# Altium project MiniPC.PrjPcb (part 15 of 17)

## Sheet 3.3V_to_VADJ.SchDoc: 3.3V to VADJ converter
size B; DocumentNumber: 43; SheetNumber: 43; SheetTotal: 46
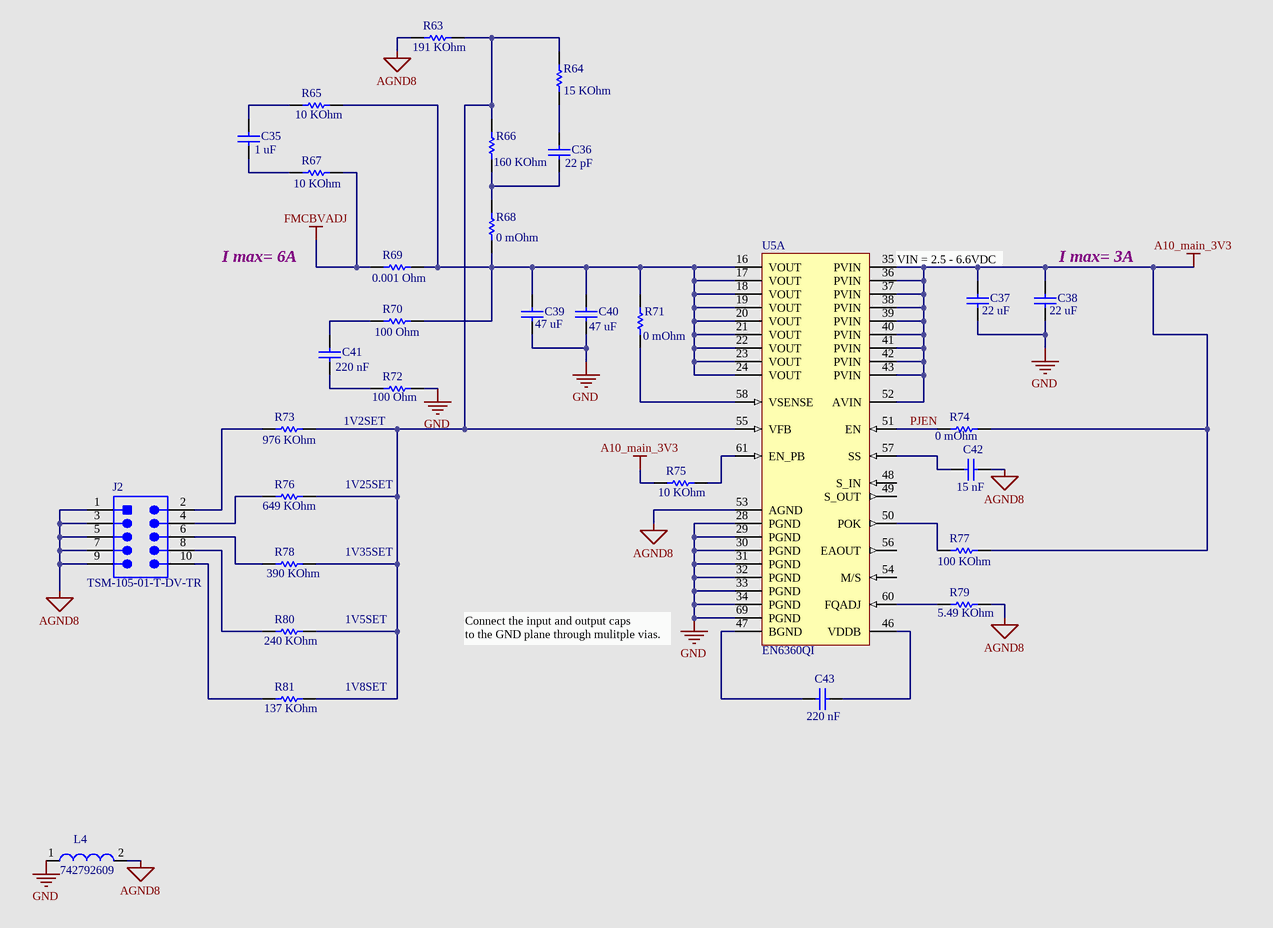
[diagram p45: 3.3V_to_VADJ.SchDoc]

### Parts
C35  Capacitance: 1 uF  [CAPC1005X33X10LL5]  (hidden comment: CGB2A1X5R1E105K033BC)
C36  Capacitance: 22 pF  [CAPC1005X55X10LL05]  (hidden comment: C1005C0G1H220J050BA)
C37  Capacitance: 22 uF  [CAPC3216X180X55ML20T25]  (hidden comment: GRM31CR61E226KE15L)
C38  Capacitance: 22 uF  [CAPC3216X180X55ML20T25]  (hidden comment: GRM31CR61E226KE15L)
C39  Capacitance: 47 uF  [CAPC3216X180X20ML20]  (hidden comment: C3216X5R1A476M160AB)
C40  Capacitance: 47 uF  [CAPC3216X180X20ML20]  (hidden comment: C3216X5R1A476M160AB)
C41  Capacitance: 220 nF  [CAPC1005X55X25NL05T10]  (hidden comment: GRM155R61A224KE19D)
C42  Capacitance: 15 nF  [CAPC1005X55X23ML05T8]  (hidden comment: VJ0402Y153JXQPW1BC)
C43  Capacitance: 220 nF  [CAPC1005X55X25NL05T10]  (hidden comment: GRM155R61A224KE19D)
J2  TSM-105-01-T-DV-TR  [SMTC-TSM-105-01-T-DV_V]
L4  742792609  [SMD-0603]
R63  Resistance: 191 KOhm  [RESC1005X40X25LL05T05]  (hidden comment: CRCW0402191KFKED)
R64  Resistance: 15 KOhm  [RESC1005X40X25ML05T05]  (hidden comment: ERJ-2RKF1502X)
R65  Resistance: 10 KOhm  [RESC1005X40X25NL05T05]  (hidden comment: ERJ-2RKF1002X)
R66  Resistance: 160 KOhm  [RESC1005X40X25ML05T05]  (hidden comment: CRCW0402160KFKED)
R67  Resistance: 10 KOhm  [RESC1005X40X25NL05T05]  (hidden comment: ERJ-2RKF1002X)
R68  Resistance: 0 mOhm  [RESC1005X40X25ML05T05]  (hidden comment: ERJ-2GE0R00X)
R69  Resistance: 0.001 Ohm  [RESC3216X89X104LL25T25]  (hidden comment: WSLP12061L000FEA)
R70  Resistance: 100 Ohm  [RESC1005X40X25LL05T05]  (hidden comment: ERJ-2RKF1000X)
R71  Resistance: 0 mOhm  [RESC1005X40X25ML05T05]  (hidden comment: ERJ-2GE0R00X)
R72  Resistance: 100 Ohm  [RESC1005X40X25LL05T05]  (hidden comment: ERJ-2RKF1000X)
R73  Resistance: 976 KOhm  [RESC1005X40X25ML05T05]  (hidden comment: CRCW0402976KFKED)
R74  Resistance: 0 mOhm  [RESC1005X40X25ML05T05]  (hidden comment: ERJ-2GE0R00X)
R75  Resistance: 10 KOhm  [RESC1005X40X25NL05T05]  (hidden comment: ERJ-2RKF1002X)
R76  Resistance: 649 KOhm  [RESC1005X40X25LL05T05]  (hidden comment: CRCW0402649KFKED)
R77  Resistance: 100 KOhm  [RESC1005X40X25LL05T05]  (hidden comment: ERJ-2RKF1003X)
R78  Resistance: 390 KOhm  [RESC1005X40X25LL05T05]  (hidden comment: CRCW0402390KFKED)
R79  Resistance: 5.49 KOhm  [RESC1005X40X25NL05T05]  (hidden comment: ERJ-2RKF5491X)
R80  Resistance: 240 KOhm  [RESC1005X40X25NL05T05]  (hidden comment: ERJ-2RKF2403X)
R81  Resistance: 137 KOhm  [RESC1005X40X25LL05T05]  (hidden comment: CRCW0402137KFKED)
U5  EN6360QI  [ALTR-QFN-68_A-305_V]  (part A of 2)

### Nets
A10_main_3V3: C37.2 C38.2 R74.2 R75.1 R77.2 U5.35(PVIN) U5.36(PVIN) U5.37(PVIN) U5.38(PVIN) U5.39(PVIN) U5.40(PVIN) U5.41(PVIN) U5.42(PVIN) U5.43(PVIN) U5.52(AVIN)
AGND8: C42.1 J2.1 J2.3 J2.5 J2.7 J2.9 L4.2 R63.1 R79.2 U5.53(AGND)
FMCBVADJ: R67.2 R69.1
GND: C37.1 C38.1 C39.1 C40.1 L4.1 R72.1 U5.28(PGND) U5.29(PGND) U5.30(PGND) U5.31(PGND) U5.32(PGND) U5.33(PGND) U5.34(PGND) U5.69(PGND)
PJEN: R74.1 U5.51(EN)
NetC35_1: C35.1 R67.1
NetC35_2: C35.2 R65.1
NetC36_1: C36.1 R66.1 R68.2
NetC36_2: C36.2 R64.1
NetC39_2: C39.2 C40.2 R65.2 R68.1 R69.2 R70.1 R71.2 U5.16(VOUT) U5.17(VOUT) U5.18(VOUT) U5.19(VOUT) U5.20(VOUT) U5.21(VOUT) U5.22(VOUT) U5.23(VOUT) U5.24(VOUT)
NetC41_1: C41.1 R70.2
NetC41_2: C41.2 R72.2
NetC42_2: C42.2 U5.57(SS)
NetC43_1: C43.1 U5.47(BGND)
NetC43_2: C43.2 U5.46(VDDB)
NetJ2_2: J2.2 R73.1
NetJ2_4: J2.4 R76.1
NetJ2_6: J2.6 R78.1
NetJ2_8: J2.8 R80.1
NetJ2_10: J2.10 R81.1
NetR63_2: R63.2 R64.2 R66.2 R73.2 R76.2 R78.2 R80.2 R81.2 U5.55(VFB)
NetR71_1: R71.1 U5.58(VSENSE)
NetR75_2: R75.2 U5.61(EN_PB)
NetR77_1: R77.1 U5.50(POK)
NetR79_1: R79.1 U5.60(FQADJ)

Not connected (* = marked no-connect by the designer): U5 48(S_IN) 49(S_OUT) 54(M/S) 56(EAOUT)

### Notes on the sheet
- I max= 6A
- VIN = 2.5 - 6.6VDC
- (near C38) I max= 3A
- 1V2SET
- 1V25SET
- 1V35SET
- 1V5SET
- Connect the input and output caps
  to the GND plane through mulitple vias.
- 1V8SET
- Title
- Size:
- Date:
- B
- Number:
- Time:
- Revision:
- Sheet
- of
- File:

### Library data of the parts
C35 = CMP-1663-00006-2: as C109 on sheet 12V_to_5V; Tolerance: 10%; PackageDescription: 2-Pin Surface Mount Device, Body 1 x 0.5 mm; PartNumber: CGB2A1X5R1E105K033BC; Case Code (Metric): 1005; DatasheetVersion: 04/2015; RoHSCompliant: True; Max Operating Temperature: 85 degC; ComponentLink2URL: https://product.tdk.com/info/en/catalog/datasheets/mlcc_commercial_lowprofile_en.pdf; Package Quantity: 1; Width: 0.02 inch; Case/Package: 0402; Case Code (Imperial): 0402; Packaging: Tape and Reel; Length: 0.039 inch; Min Operating Temperature: -55 degC; Mounting Technology: Surface Mount; ComponentLink2Description: Datasheet; ComponentLink1URL: http://www.tdk.com/; ComponentLink1Description: Manufacturer URL
C36 = CMP-1663-00008-2: as C8 on sheet 3.3V_to_0.9V; Tolerance: 5%; ComponentLink2URL: https://product.tdk.com/info/en/catalog/datasheets/mlcc_commercial_general_en.pdf; RoHSCompliant: true; Mounting Technology: Surface Mount; Case Code (Metric): 1005; PackageDescription: 2-Pin Surface Mount Device, Body 1 x 0.5 mm; ComponentLink1URL: http://www.tdk.com/; Packaging: Tape and Reel; ComponentLink1Description: Manufacturer URL; PackageReference: 0402; Package Quantity: 10000; DatasheetVersion: 08/2016; Width: 0.5 mm; Max Operating Temperature: 125 degC; Mount: Surface Mount; Height: 0.5 mm; REACH SVHC: No SVHC; Length: 1 mm; Min Operating Temperature: -55 degC; Pins: 2; Case Code (Imperial): 0402; Radiation Hardening: No; ComponentLink2Description: Datasheet; Voltage Rating (DC): 50 V; PartNumber: C1005C0G1H220J050BA
C37 C38 = CMP-1662-00010-2: as C116 on sheet 12V_to_5V; Tolerance: 10%; Max Operating Temperature: 85 degC; Package Quantity: 2000; Voltage Rating: 25 V; Case Code (Metric): 3216; Length: 3.2 mm; PackageDescription: 2-Pin Surface Mount Device, Body 3.2 x 1.6 mm; ComponentLink1Description: Manufacturer URL; Case Code (Imperial): 1206; ComponentLink1URL: http://www.murata.com/; Radiation Hardening: No; Height: 1.6 mm; Width: 1.6 mm; DatasheetVersion: 03/2016; Min Operating Temperature: -55 degC; Mount: Surface Mount; REACH SVHC: No SVHC; PackageReference: 1206; ComponentLink2URL: http://search.murata.co.jp/Ceramy/image/img/A01X/G101/ENG/GRM31CR61E226KE15-01.pdf; Packaging: Tape and Reel; RoHSCompliant: true; ComponentLink2Description: Datasheet; Mounting Technology: Surface Mount; PartNumber: GRM31CR61E226KE15L; Pins: 2
C39 C40 = CMP-1663-00005-1: as C112 on sheet 12V_to_5V; Tolerance: 20%; Voltage Rating: 10 V; Packaging: Tape and Reel; ComponentLink2URL: https://product.tdk.com/info/en/catalog/datasheets/mlcc_commercial_general_en.pdf; Min Operating Temperature: -55 degC; Length: 3.2 mm; Radiation Hardening: No; Mounting Technology: Surface Mount; PackageDescription: 2-Pin Surface Mount Device, Body 3.2 x 1.6 mm; Max Operating Temperature: 85 degC; Case Code (Metric): 3216; ComponentLink1URL: http://www.tdk.com/; DatasheetVersion: 03/2015; Mount: Surface Mount; Case Code (Imperial): 1206; Package Quantity: 2000; ComponentLink2Description: Datasheet; PackageReference: 3216; Height: 1.6 mm; RoHSCompliant: true; Width: 1.6 mm; ComponentLink1Description: Manufacturer URL
C41 C43 = CMP-2008-04561-4: as C115 on sheet 12V_to_5V; ComponentLink1URL: http://www.murata.com/; Package Quantity: 1; Tolerance: 10%; Mounting Technology: Surface Mount; RoHSCompliant: true; PartNumber: GRM155R61A224KE19D; Max Operating Temperature: 85 degC; Case Code (Imperial): 0402; Length: 1 mm; Packaging: Tape and Reel; Min Operating Temperature: -55 degC; PackageDescription: 2-Pin Surface Mount Device, Body 1 x 0.5 mm; Height: 0.5 mm; Case Code (Metric): 1005; REACH SVHC: No SVHC; ComponentLink1Description: Manufacturer URL; Width: 0.5 mm; ComponentLink2URL: http://search.murata.co.jp/Ceramy/image/img/A01X/G101/ENG/GRM155R61A224KE19-01.pdf; Radiation Hardening: No; Pins: 2; Voltage Rating (DC): 10 V; DatasheetVersion: 03/2016; Mount: Surface Mount; PackageReference: 0402; ComponentLink2Description: Datasheet
C42 = CMP-1666-00015-3: as C14 on sheet 3.3V_to_0.9V; DatasheetVersion: 07/2016; ComponentLink1Description: Manufacturer URL; ComponentLink1URL: http://www.vishay.com/; PackageDescription: 2-Pin Surface Mount Device, Body 1 x 0.5 mm; ComponentLink2URL: http://www.vishay.com/docs/28548/vjw1bcbascomseries.pdf; ComponentLink2Description: Datasheet; Mounting Technology: Surface Mount; Length: 1 mm; PartNumber: VJ0402Y153JXQPW1BC; RoHSCompliant: true; Package Quantity: 50000; Min Operating Temperature: -55 degC; Case Code (Metric): 1005; Max Operating Temperature: 125 degC; Width: 0.5 mm; Tolerance: 5%; Packaging: Tape and Reel; Case Code (Imperial): 0402; Height: 0.5 mm; PackageReference: 0402; Mount: Surface Mount; Pins: 2; Voltage Rating: 10 V
J2 = CMP-1707-00003-1: Male Header, Pitch 2.54 mm, 2 x 5 Position, Height 9.65 mm, -55 to 105 degC, RoHS, Tape and Reel; Manufacturer: Samtec; PackageDescription: Male Header, Pitch 2.54 mm, 2 x 5 Position, Height 9.65 mm; PartNumber: TSM-105-01-T-DV-TR; PackageReference: TSM-105-01-T-DV; ComponentLink1URL: http://www.samtec.com/; ComponentLink1Description: Manufacturer URL; ComponentLink2Description: Datasheet; ComponentLink2URL: http://suddendocs.samtec.com/catalog_english/tsm.pdf; Mounting Technology: Surface Mount; DatasheetVersion: Rev. 31DEC15; ComponentLink3URL: http://suddendocs.samtec.com/prints/tsm-dv-footprint.pdf; ComponentLink3Description: Package Specification
L4 = CMP-0220-00193-1: as L10 on sheet 12V_to_5V; ComponentLink2URL: http://www.we-online.de/katalog/media/pdf/742792609.pdf; ComponentLink1URL: http://www.we-online.com; ComponentLink2Description: Datasheet; PackageDescription: Chip Inductor, 2-Leads, Body 1.6 x 0.8 mm; ComponentLink1Description: Manufacturer Link; PackageReference: SMD-0603; DatasheetVersion: Dec-2005; PackageVersion: 2009
R63 = CMP-2002-08268-3: as R49 on sheet 3.3V_to_DDR4_VDD; Case Code (Imperial): 0402; Height: 0.35 mm; PackageDescription: 2-Pin Surface Mount Device, Body 1 x 0.5 mm; REACH SVHC: Unknown; ComponentLink1URL: http://www.vishay.com/; Tolerance: 1%; Width: 0.5 mm; Package Quantity: 10000; ComponentLink1Description: Manufacturer URL; Packaging: Tape and Reel; Min Operating Temperature: -55 degC; Length: 1 mm; Case Code (Metric): 1005; Max Operating Temperature: 155 degC; Mounting Technology: Surface Mount; Mount: Surface Mount; RoHSCompliant: true; PartNumber: CRCW0402191KFKED; Weight: 2.3E-05oz; ComponentLink2URL: http://www.vishay.com/docs/20035/dcrcwe3.pdf; DatasheetVersion: 06/2012; ComponentLink2Description: Datasheet; Radiation Hardening: No; PackageReference: 0402; Pins: 2
R64 = CMP-2002-00694-3: as R22 on sheet 3.3V_to_0.9V; Max Operating Temperature: 155 degC; Case Code (Imperial): 0402; Case Code (Metric): 1005; PartNumber: ERJ-2RKF1502X; Package Quantity: 10000; REACH SVHC: Yes; Width: 0.5 mm; Mount: Surface Mount; Mounting Technology: Surface Mount; Packaging: Tape and Reel; Tolerance: 1%; ComponentLink1Description: Manufacturer URL; ComponentLink1URL: http://www.panasonic.com/; Height: 0.35 mm; Length: 1 mm; PackageDescription: 2-Pin Surface Mount Device, Body 1 x 0.5 mm; Min Operating Temperature: -55 degC; RoHSCompliant: true; Pins: 2; PackageReference: 0402; DatasheetVersion: 04/2015; ComponentLink2URL: http://industrial.panasonic.com/cdbs/www-data/pdf/RDA0000/AOA0000C86.pdf; Weight: 2.8E-05oz; Radiation Hardening: No; ComponentLink2Description: Datasheet
R65 R67 R75 = CMP-2002-00607-3: as R175 on sheet 12V_to_5V; Case Code (Imperial): 0402; Min Operating Temperature: -55 degC; PartNumber: ERJ-2RKF1002X; Mounting Technology: Surface Mount; Length: 1 mm; Packaging: Tape and Reel; ComponentLink1Description: Manufacturer URL; Mount: Surface Mount; Package Quantity: 10000; Max Operating Temperature: 155 degC; Case Code (Metric): 1005; Height: 0.35 mm; ComponentLink1URL: http://www.panasonic.com/; Tolerance: 1%; REACH SVHC: Yes; RoHSCompliant: true; Width: 0.5 mm; PackageDescription: 2-Pin Surface Mount Device, Body 1 x 0.5 mm; Radiation Hardening: No; PackageReference: 0402; ComponentLink2Description: Datasheet; DatasheetVersion: 04/2015; ComponentLink2URL: http://industrial.panasonic.com/cdbs/www-data/pdf/RDA0000/AOA0000C86.pdf; Pins: 2
R66 = CMP-2002-08227-3: as R24 on sheet 3.3V_to_0.9V; Tolerance: 1%; Min Operating Temperature: -55 degC; Length: 1 mm; Height: 0.35 mm; Package Quantity: 10; Mounting Technology: Surface Mount; Mount: Surface Mount; Max Operating Temperature: 155 degC; PartNumber: CRCW0402160KFKED; Case Code (Imperial): 0402; Packaging: Tape and Reel; ComponentLink1Description: Manufacturer URL; Case Code (Metric): 1005; ComponentLink1URL: http://www.vishay.com/; RoHSCompliant: true; REACH SVHC: Unknown; PackageDescription: 2-Pin Surface Mount Device, Body 1 x 0.5 mm; Width: 0.5 mm; ComponentLink2Description: Datasheet; Pins: 2; PackageReference: 0402; Weight: 2.3E-05oz; ComponentLink2URL: http://www.vishay.com/docs/20035/dcrcwe3.pdf; Radiation Hardening: No; DatasheetVersion: 06/2012
R68 R71 R74 = CMP-2002-00429-3: as R173 on sheet 12V_to_5V; Max Operating Temperature: 155 degC; Tolerance: 5%; PartNumber: ERJ-2GE0R00X; Case Code (Imperial): 0402; Package Quantity: 10000; Length: 1 mm; Mounting Technology: Surface Mount; ComponentLink1URL: http://www.panasonic.com/; Height: 0.35 mm; Width: 0.5 mm; Min Operating Temperature: -55 degC; Case Code (Metric): 1005; RoHSCompliant: true; REACH SVHC: Unknown; ComponentLink1Description: Manufacturer URL; Packaging: Tape and Reel; Mount: Surface Mount; PackageDescription: 2-Pin Surface Mount Device, Body 1 x 0.5 mm; PackageReference: 0402; ComponentLink2URL: http://industrial.panasonic.com/cdbs/www-data/pdf/RDA0000/AOA0000C84.pdf; DatasheetVersion: 03/2015; Radiation Hardening: No; Pins: 2; ComponentLink2Description: Datasheet
R69 = CMP-1666-00018-2: as R27 on sheet 3.3V_to_0.9V; Tolerance: 1%; RoHSCompliant: True; Mounting Technology: Surface Mount; ComponentLink1URL: http://www.vishay.com/; Min Operating Temperature: -65 degC; Height: 0.635 mm; ComponentLink2URL: http://www.farnell.com/datasheets/2049155.pdf; Length: 3.2 mm; ComponentLink2Description: Datasheet; ComponentLink1Description: Manufacturer URL; DatasheetVersion: 04/2015; Case Code (Imperial): 1206; Max Operating Temperature: 170 degC; Packaging: Tape and Reel; Case/Package: 1206; Width: 1.6 mm; PartNumber: WSLP12061L000FEA; REACH SVHC: Unknown; PackageDescription: 2-Pin Surface Mount Device, Body 3.2 x 1.6 mm; Case Code (Metric): 3216
R70 R72 = CMP-2002-00605-3: as R28 on sheet 3.3V_to_0.9V; ComponentLink1URL: http://www.panasonic.com/; Package Quantity: 10000; Packaging: Tape and Reel; PackageDescription: 2-Pin Surface Mount Device, Body 1 x 0.5 mm; Tolerance: 1%; ComponentLink1Description: Manufacturer URL; REACH SVHC: Yes; Case Code (Imperial): 0402; Mounting Technology: Surface Mount; Min Operating Temperature: -55 degC; RoHSCompliant: true; Length: 1 mm; Width: 0.5 mm; Height: 0.35 mm; Max Operating Temperature: 155 degC; PartNumber: ERJ-2RKF1000X; Mount: Surface Mount; Case Code (Metric): 1005; Pins: 2; ComponentLink2Description: Datasheet; PackageReference: 0402; DatasheetVersion: 04/2015; Radiation Hardening: No; ComponentLink2URL: http://industrial.panasonic.com/cdbs/www-data/pdf/RDA0000/AOA0000C86.pdf
R73 = CMP-2002-00281-3: Chip Resistor, 976 KOhm, +/- 1%, 63 mW, -55 to 155 degC, 0402 (1005 Metric), RoHS, Tape and Reel; Manufacturer: Basic Passives; Power Rating: 63 mW; Voltage Rating: 50 V; Case\/Package: 0402; ComponentLink1URL: http://www.vishay.com/; Mounting Technology: Surface Mount; Package Quantity: 10000; PartNumber: CRCW0402976KFKED; Packaging: Tape and Reel; Height: 0.35 mm; PackageDescription: 2-Pin Surface Mount Device, Body 1 x 0.5 mm; Case Code (Metric): 1005; Max Operating Temperature: 155 degC; Case Code (Imperial): 0402; Width: 0.5 mm; Tolerance: 1%; ComponentLink1Description: Manufacturer URL; RoHSCompliant: true; Min Operating Temperature: -55 degC; Length: 1 mm; REACH SVHC: Unknown; Mount: Surface Mount; Radiation Hardening: No; Weight: 2.3E-05oz; DatasheetVersion: 06/2012; ComponentLink2URL: http://www.vishay.com/docs/20035/dcrcwe3.pdf; Pins: 2; PackageReference: 0402; ComponentLink2Description: Datasheet
R76 = CMP-2002-00156-3: Chip Resistor, 649 KOhm, +/- 1%, 63 mW, -55 to 155 degC, 0402 (1005 Metric), RoHS, Tape and Reel; Manufacturer: Basic Passives; Power Rating: 63 mW; Voltage Rating: 50 V; Case\/Package: 0402; Height: 0.35 mm; Case Code (Imperial): 0402; ComponentLink1URL: http://www.vishay.com/; Package Quantity: 10; Packaging: Tape and Reel; Min Operating Temperature: -55 degC; PartNumber: CRCW0402649KFKED; ComponentLink1Description: Manufacturer URL; Mounting Technology: Surface Mount; Mount: Surface Mount; Tolerance: 1%; Length: 1 mm; Case Code (Metric): 1005; Width: 0.5 mm; RoHSCompliant: true; REACH SVHC: No SVHC; PackageDescription: 2-Pin Surface Mount Device, Body 1 x 0.5 mm; Max Operating Temperature: 155 degC; DatasheetVersion: 06/2012; ComponentLink2Description: Datasheet; Pins: 2; Weight: 2.3E-05oz; Radiation Hardening: No; ComponentLink2URL: http://www.vishay.com/docs/20035/dcrcwe3.pdf; PackageReference: 0402
R77 = CMP-2002-00608-3: as R176 on sheet 12V_to_5V; Height: 0.35 mm; ComponentLink1Description: Manufacturer URL; Packaging: Tape and Reel; Min Operating Temperature: -55 degC; RoHSCompliant: true; PackageDescription: 2-Pin Surface Mount Device, Body 1 x 0.5 mm; Mount: Surface Mount; Package Quantity: 10000; Max Operating Temperature: 155 degC; ComponentLink1URL: http://www.panasonic.com/; Tolerance: 1%; Mounting Technology: Surface Mount; PartNumber: ERJ-2RKF1003X; Case Code (Metric): 1005; Case Code (Imperial): 0402; REACH SVHC: Yes; Length: 1 mm; Width: 0.5 mm; DatasheetVersion: 04/2015; Pins: 2; ComponentLink2Description: Datasheet; ComponentLink2URL: http://industrial.panasonic.com/cdbs/www-data/pdf/RDA0000/AOA0000C86.pdf; PackageReference: 0402; Radiation Hardening: No
R78 = CMP-2002-08563-3: Chip Resistor, 390 KOhm, +/- 1%, 63 mW, -55 to 155 degC, 0402 (1005 Metric), RoHS, Tape and Reel; Manufacturer: Basic Passives; Power Rating: 63 mW; Voltage Rating: 50 V; Case\/Package: 0402; ComponentLink1URL: http://www.vishay.com/; Case Code (Imperial): 0402; Length: 1 mm; Max Operating Temperature: 155 degC; ComponentLink1Description: Manufacturer URL; PartNumber: CRCW0402390KFKED; REACH SVHC: Unknown; RoHSCompliant: true; Package Quantity: 10000; Mounting Technology: Surface Mount; PackageDescription: 2-Pin Surface Mount Device, Body 1 x 0.5 mm; Packaging: Tape and Reel; Case Code (Metric): 1005; Height: 0.35 mm; Width: 0.5 mm; Tolerance: 1%; Min Operating Temperature: -55 degC; Mount: Surface Mount; DatasheetVersion: 06/2012; Radiation Hardening: No; Weight: 2.3E-05oz; ComponentLink2URL: http://www.vishay.com/docs/20035/dcrcwe3.pdf; PackageReference: 0402; ComponentLink2Description: Datasheet; Pins: 2
R79 = CMP-2002-00990-3: as R62 on sheet 3.3V_to_DDR4_VDD; Tolerance: 1%; Packaging: Tape and Reel; RoHSCompliant: true; Length: 0.039 inch; PackageDescription: 2-Pin Surface Mount Device, Body 1 x 0.5 mm; Height: 0.016 inch; Case Code (Imperial): 0402; Min Operating Temperature: -55 degC; PartNumber: ERJ-2RKF5491X; Case Code (Metric): 1005; ComponentLink1Description: Manufacturer URL; Width: 0.02 inch; Package Quantity: 10000; ComponentLink1URL: http://www.panasonic.com/; Mount: Surface Mount; Mounting Technology: Surface Mount; REACH SVHC: Yes; Max Operating Temperature: 155 degC; ComponentLink2URL: http://industrial.panasonic.com/cdbs/www-data/pdf/RDA0000/AOA0000C86.pdf; Pins: 2; ComponentLink2Description: Datasheet; PackageReference: 0402; DatasheetVersion: 04/2015
R80 = CMP-2002-00799-3: Chip Resistor, 240 KOhm, +/- 1%, 100 mW, -55 to 155 degC, 0402 (1005 Metric), RoHS, Tape and Reel; Manufacturer: Basic Passives; Voltage Rating: 50 V; Power Rating: 100 mW; Case\/Package: 0402; Height: 0.35 mm; Length: 1 mm; ComponentLink1URL: http://www.panasonic.com/; Max Operating Temperature: 155 degC; PackageDescription: 2-Pin Surface Mount Device, Body 1 x 0.5 mm; PartNumber: ERJ-2RKF2403X; Min Operating Temperature: -55 degC; Tolerance: 1%; Case Code (Imperial): 0402; Case Code (Metric): 1005; RoHSCompliant: true; Package Quantity: 10000; Mount: Surface Mount; REACH SVHC: Unknown; Mounting Technology: Surface Mount; Packaging: Tape and Reel; ComponentLink1Description: Manufacturer URL; Width: 0.5 mm; DatasheetVersion: 04/2015; PackageReference: 0402; Radiation Hardening: No; Pins: 2; ComponentLink2URL: http://industrial.panasonic.com/cdbs/www-data/pdf/RDA0000/AOA0000C86.pdf; ComponentLink2Description: Datasheet
R81 = CMP-2002-08193-3: Chip Resistor, 137 KOhm, +/- 1%, 63 mW, -55 to 155 degC, 0402 (1005 Metric), RoHS, Tape and Reel; Manufacturer: Basic Passives; Power Rating: 63 mW; Voltage Rating: 50 V; Case\/Package: 0402; ComponentLink1URL: http://www.vishay.com/; Width: 0.5 mm; PartNumber: CRCW0402137KFKED; Tolerance: 1%; Packaging: Tape and Reel; Min Operating Temperature: -55 degC; Max Operating Temperature: 155 degC; Case Code (Imperial): 0402; Length: 1 mm; Height: 0.35 mm; Package Quantity: 10000; REACH SVHC: Unknown; Mount: Surface Mount; ComponentLink1Description: Manufacturer URL; PackageDescription: 2-Pin Surface Mount Device, Body 1 x 0.5 mm; RoHSCompliant: true; Case Code (Metric): 1005; Mounting Technology: Surface Mount; Radiation Hardening: No; PackageReference: 0402; DatasheetVersion: 06/2012; ComponentLink2URL: http://www.vishay.com/docs/20035/dcrcwe3.pdf; ComponentLink2Description: Datasheet; Pins: 2; Weight: 2.3E-05oz
U5 = CMP-1689-00004-3: as U2 on sheet 3.3V_to_0.9V; Mounting Technology: Surface Mount; ComponentLink2URL: https://www.altera.com/content/dam/altera-www/global/en_US/pdfs/literature/ds/en6360qi_06489.pdf; PackageVersion: Rev. A, 10/2014; ComponentLink3Description: Package Specification; ComponentLink3URL: http://wl.altera.com/literature/ds/EN6360QA_10396.pdf; ComponentLink1Description: Manufacturer URL; PartNumber: EN6360QI; ComponentLink2Description: Datasheet; PackageDescription: 68-Pin Quad-Flat No-Leads Package, Body 11 x 8 mm, Pitch 0.5 mm; ComponentLink1URL: https://www.altera.com/; Code_JEDEC: J-STD-020A; DatasheetVersion: Rev. G; Mount: Surface Mount; Max Operating Temperature: 85 degC; Pins: 68; Radiation Hardening: No; Min Operating Temperature: -40 degC; Packaging: Tape and Reel; Package Quantity: 250; RoHSCompliant: True; Width: 0.32 inch; Length: 0.43 inch; Height: 0.12 inch

## Sheet 3V3_to_0V9.SchDoc: 3.3V to 0.9V Converter
size B; DocumentNumber: 44; SheetNumber: 44; SheetTotal: 46
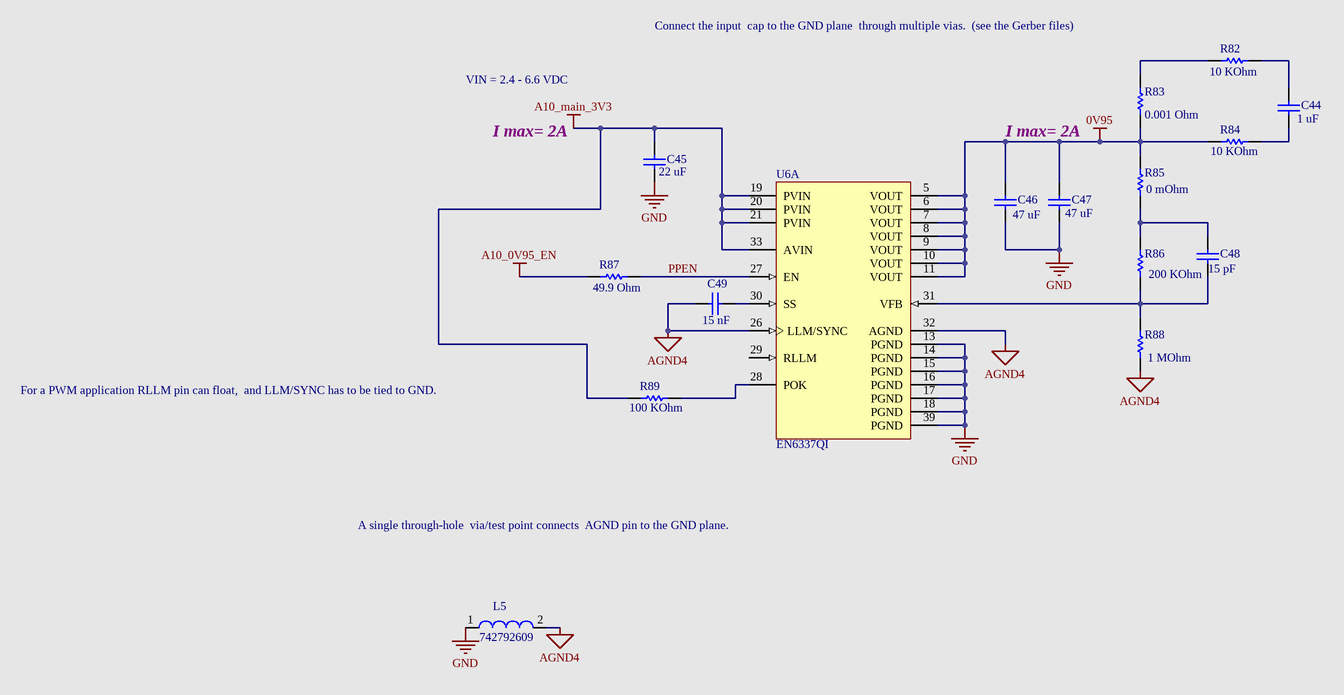
[diagram p46: 3V3_to_0V9.SchDoc]

### Parts
C44  Capacitance: 1 uF  [CAPC1005X33X10LL5]  (hidden comment: CGB2A1X5R1E105K033BC)
C45  Capacitance: 22 uF  [CAPC3216X180X55ML20T25]  (hidden comment: GRM31CR61E226KE15L)
C46  Capacitance: 47 uF  [CAPC3216X180X20ML20]  (hidden comment: C3216X5R1A476M160AB)
C47  Capacitance: 47 uF  [CAPC3216X180X20ML20]  (hidden comment: C3216X5R1A476M160AB)
C48  Capacitance: 15 pF  [CAPC1005X55X20ML5T10]  (hidden comment: ECJ-0EC1H150J)
C49  Capacitance: 15 nF  [CAPC1005X55X23ML05T8]  (hidden comment: VJ0402Y153JXQPW1BC)
L5  742792609  [SMD-0603]
R82  Resistance: 10 KOhm  [RESC1005X40X25NL05T05]  (hidden comment: ERJ-2RKF1002X)
R83  Resistance: 0.001 Ohm  [RESC3216X89X104LL25T25]  (hidden comment: WSLP12061L000FEA)
R84  Resistance: 10 KOhm  [RESC1005X40X25NL05T05]  (hidden comment: ERJ-2RKF1002X)
R85  Resistance: 0 mOhm  [RESC1005X40X25ML05T05]  (hidden comment: ERJ-2GE0R00X)
R86  Resistance: 200 KOhm  [RESC1005X40X25NL05T05]  (hidden comment: ERJ-2RKF2003X)
R87  Resistance: 49.9 Ohm  [RESC1005X35X25NL8T10]  (hidden comment: NRC04F49R9TRF)
R88  Resistance: 1 MOhm  [RESC1005X40X25LL05T05]  (hidden comment: ERJ-2RKF1004X)
R89  Resistance: 100 KOhm  [RESC1005X40X25LL05T05]  (hidden comment: ERJ-2RKF1003X)
U6  EN6337QI  [ALTR-QFN-38_A-190_D1-193_V]  (part A of 2)

### Nets
0V95: C46.2 C47.2 R83.2 R84.2 R85.1 U6.5(VOUT) U6.6(VOUT) U6.7(VOUT) U6.8(VOUT) U6.9(VOUT) U6.10(VOUT) U6.11(VOUT)
A10_0V95_EN: R87.1
A10_main_3V3: C45.2 R89.1 U6.19(PVIN) U6.20(PVIN) U6.21(PVIN) U6.33(AVIN)
AGND4: C49.1 L5.2 R88.1 U6.26(LLM/SYNC) U6.32(AGND)
GND: C45.1 C46.1 C47.1 L5.1 U6.13(PGND) U6.14(PGND) U6.15(PGND) U6.16(PGND) U6.17(PGND) U6.18(PGND) U6.39(PGND)
PPEN: R87.2 U6.27(EN)
NetC44_1: C44.1 R84.1
NetC44_2: C44.2 R82.1
NetC48_1: C48.1 R86.1 R88.2 U6.31(VFB)
NetC48_2: C48.2 R85.2 R86.2
NetC49_2: C49.2 U6.30(SS)
NetR82_2: R82.2 R83.1
NetR89_2: R89.2 U6.28(POK)

Not connected (* = marked no-connect by the designer): U6 29(RLLM)

### Notes on the sheet
- Connect the input  cap to the GND plane  through multiple vias.  (see the Gerber files)
- VIN = 2.4 - 6.6 VDC
- I max= 2A
- For a PWM application RLLM pin can float,  and LLM/SYNC has to be tied to GND.
- A single through-hole  via/test point connects  AGND pin to the GND plane.
- Title
- Size:
- Date:
- B
- Number:
- Time:
- Revision:
- Sheet
- of
- File:

### Library data of the parts
C44 = CMP-1663-00006-2: as C109 on sheet 12V_to_5V; Tolerance: 10%; PackageDescription: 2-Pin Surface Mount Device, Body 1 x 0.5 mm; PartNumber: CGB2A1X5R1E105K033BC; Case Code (Metric): 1005; DatasheetVersion: 04/2015; RoHSCompliant: True; Max Operating Temperature: 85 degC; ComponentLink2URL: https://product.tdk.com/info/en/catalog/datasheets/mlcc_commercial_lowprofile_en.pdf; Package Quantity: 1; Width: 0.02 inch; Case/Package: 0402; Case Code (Imperial): 0402; Packaging: Tape and Reel; Length: 0.039 inch; Min Operating Temperature: -55 degC; Mounting Technology: Surface Mount; ComponentLink2Description: Datasheet; ComponentLink1URL: http://www.tdk.com/; ComponentLink1Description: Manufacturer URL
C45 = CMP-1662-00010-2: as C116 on sheet 12V_to_5V; Tolerance: 10%; Max Operating Temperature: 85 degC; Package Quantity: 2000; Voltage Rating: 25 V; Case Code (Metric): 3216; Length: 3.2 mm; PackageDescription: 2-Pin Surface Mount Device, Body 3.2 x 1.6 mm; ComponentLink1Description: Manufacturer URL; Case Code (Imperial): 1206; ComponentLink1URL: http://www.murata.com/; Radiation Hardening: No; Height: 1.6 mm; Width: 1.6 mm; DatasheetVersion: 03/2016; Min Operating Temperature: -55 degC; Mount: Surface Mount; REACH SVHC: No SVHC; PackageReference: 1206; ComponentLink2URL: http://search.murata.co.jp/Ceramy/image/img/A01X/G101/ENG/GRM31CR61E226KE15-01.pdf; Packaging: Tape and Reel; RoHSCompliant: true; ComponentLink2Description: Datasheet; Mounting Technology: Surface Mount; PartNumber: GRM31CR61E226KE15L; Pins: 2
C46 C47 = CMP-1663-00005-1: as C112 on sheet 12V_to_5V; Tolerance: 20%; Voltage Rating: 10 V; Packaging: Tape and Reel; ComponentLink2URL: https://product.tdk.com/info/en/catalog/datasheets/mlcc_commercial_general_en.pdf; Min Operating Temperature: -55 degC; Length: 3.2 mm; Radiation Hardening: No; Mounting Technology: Surface Mount; PackageDescription: 2-Pin Surface Mount Device, Body 3.2 x 1.6 mm; Max Operating Temperature: 85 degC; Case Code (Metric): 3216; ComponentLink1URL: http://www.tdk.com/; DatasheetVersion: 03/2015; Mount: Surface Mount; Case Code (Imperial): 1206; Package Quantity: 2000; ComponentLink2Description: Datasheet; PackageReference: 3216; Height: 1.6 mm; RoHSCompliant: true; Width: 1.6 mm; ComponentLink1Description: Manufacturer URL
C48 = CMP-1665-00025-1: Chip Capacitor,15 pF, +/- 5%, 50 V, -55 to 125 degC, 0402 (1005 Metric), RoHS, Tape and Reel; Case\/Package: 0402; Type (Capacitors): C0G; Voltage Rating: 50 V; Tolerance: 5%; Mount: Surface Mount; Length: 0.039 inch; ComponentLink1Description: Manufacturer URL; Height: 0.5 mm; PackageReference: 0402; DatasheetVersion: 09/2008; Case Code (Metric): 1005; ComponentLink2URL: http://www.mouser.com/ds/2/315/panasonic_abj0000ce4-327307.pdf; Width: 0.02 inch; Mounting Technology: Surface Mount; Case Code (Imperial): 0402; PackageDescription: 2-Pin Surface Mount Device, Body 1 x 0.5 mm; Packaging: Tape and Reel; ComponentLink1URL: http://www.panasonic.com/; RoHSCompliant: true; Max Operating Temperature: 125 degC; Package Quantity: 10000; Min Operating Temperature: -55 degC; ComponentLink2Description: Datasheet
C49 = CMP-1666-00015-3: as C14 on sheet 3.3V_to_0.9V; DatasheetVersion: 07/2016; ComponentLink1Description: Manufacturer URL; ComponentLink1URL: http://www.vishay.com/; PackageDescription: 2-Pin Surface Mount Device, Body 1 x 0.5 mm; ComponentLink2URL: http://www.vishay.com/docs/28548/vjw1bcbascomseries.pdf; ComponentLink2Description: Datasheet; Mounting Technology: Surface Mount; Length: 1 mm; PartNumber: VJ0402Y153JXQPW1BC; RoHSCompliant: true; Package Quantity: 50000; Min Operating Temperature: -55 degC; Case Code (Metric): 1005; Max Operating Temperature: 125 degC; Width: 0.5 mm; Tolerance: 5%; Packaging: Tape and Reel; Case Code (Imperial): 0402; Height: 0.5 mm; PackageReference: 0402; Mount: Surface Mount; Pins: 2; Voltage Rating: 10 V
L5 = CMP-0220-00193-1: as L10 on sheet 12V_to_5V; ComponentLink2URL: http://www.we-online.de/katalog/media/pdf/742792609.pdf; ComponentLink1URL: http://www.we-online.com; ComponentLink2Description: Datasheet; PackageDescription: Chip Inductor, 2-Leads, Body 1.6 x 0.8 mm; ComponentLink1Description: Manufacturer Link; PackageReference: SMD-0603; DatasheetVersion: Dec-2005; PackageVersion: 2009
R82 R84 = CMP-2002-00607-3: as R175 on sheet 12V_to_5V; Case Code (Imperial): 0402; Min Operating Temperature: -55 degC; PartNumber: ERJ-2RKF1002X; Mounting Technology: Surface Mount; Length: 1 mm; Packaging: Tape and Reel; ComponentLink1Description: Manufacturer URL; Mount: Surface Mount; Package Quantity: 10000; Max Operating Temperature: 155 degC; Case Code (Metric): 1005; Height: 0.35 mm; ComponentLink1URL: http://www.panasonic.com/; Tolerance: 1%; REACH SVHC: Yes; RoHSCompliant: true; Width: 0.5 mm; PackageDescription: 2-Pin Surface Mount Device, Body 1 x 0.5 mm; Radiation Hardening: No; PackageReference: 0402; ComponentLink2Description: Datasheet; DatasheetVersion: 04/2015; ComponentLink2URL: http://industrial.panasonic.com/cdbs/www-data/pdf/RDA0000/AOA0000C86.pdf; Pins: 2
R83 = CMP-1666-00018-2: as R27 on sheet 3.3V_to_0.9V; Tolerance: 1%; RoHSCompliant: True; Mounting Technology: Surface Mount; ComponentLink1URL: http://www.vishay.com/; Min Operating Temperature: -65 degC; Height: 0.635 mm; ComponentLink2URL: http://www.farnell.com/datasheets/2049155.pdf; Length: 3.2 mm; ComponentLink2Description: Datasheet; ComponentLink1Description: Manufacturer URL; DatasheetVersion: 04/2015; Case Code (Imperial): 1206; Max Operating Temperature: 170 degC; Packaging: Tape and Reel; Case/Package: 1206; Width: 1.6 mm; PartNumber: WSLP12061L000FEA; REACH SVHC: Unknown; PackageDescription: 2-Pin Surface Mount Device, Body 3.2 x 1.6 mm; Case Code (Metric): 3216
R85 = CMP-2002-00429-3: as R173 on sheet 12V_to_5V; Max Operating Temperature: 155 degC; Tolerance: 5%; PartNumber: ERJ-2GE0R00X; Case Code (Imperial): 0402; Package Quantity: 10000; Length: 1 mm; Mounting Technology: Surface Mount; ComponentLink1URL: http://www.panasonic.com/; Height: 0.35 mm; Width: 0.5 mm; Min Operating Temperature: -55 degC; Case Code (Metric): 1005; RoHSCompliant: true; REACH SVHC: Unknown; ComponentLink1Description: Manufacturer URL; Packaging: Tape and Reel; Mount: Surface Mount; PackageDescription: 2-Pin Surface Mount Device, Body 1 x 0.5 mm; PackageReference: 0402; ComponentLink2URL: http://industrial.panasonic.com/cdbs/www-data/pdf/RDA0000/AOA0000C84.pdf; DatasheetVersion: 03/2015; Radiation Hardening: No; Pins: 2; ComponentLink2Description: Datasheet
R86 = CMP-2002-00760-3: Chip Resistor, 200 KOhm, +/- 1%, 100 mW, -55 to 155 degC, 0402 (1005 Metric), RoHS, Tape and Reel; Manufacturer: Basic Passives; Power Rating: 100 mW; Voltage Rating: 50 V; Case\/Package: 0402; ComponentLink1Description: Manufacturer URL; PackageDescription: 2-Pin Surface Mount Device, Body 1 x 0.5 mm; RoHSCompliant: true; PartNumber: ERJ-2RKF2003X; Max Operating Temperature: 155 degC; Width: 0.5 mm; Mounting Technology: Surface Mount; Package Quantity: 10000; REACH SVHC: No SVHC; Packaging: Tape and Reel; Length: 1 mm; Mount: Surface Mount; ComponentLink1URL: http://www.panasonic.com/; Case Code (Imperial): 0402; Min Operating Temperature: -55 degC; Height: 0.35 mm; Tolerance: 1%; Case Code (Metric): 1005; DatasheetVersion: 04/2015; ComponentLink2URL: http://industrial.panasonic.com/cdbs/www-data/pdf/RDA0000/AOA0000C86.pdf; ComponentLink2Description: Datasheet; PackageReference: 0402; Radiation Hardening: No; Pins: 2
R87 = CMP-1599-00001-2: as R31 on sheet 3.3V_to_0.9V; Tolerance: 1%; ComponentLink2Description: Datasheet; RoHSCompliant: True; DatasheetVersion: 11/2008; Max Operating Temperature: 155 degC; PartNumber: NRC04F49R9TRF; Radiation Hardening: No; PackageDescription: 2-Pin Surface Mount Device, Body 1 x 0.5 mm; Case/Package: 0402; Height: 0.3 mm; Length: 1 mm; ComponentLink1Description: Manufacturer URL; ComponentLink1URL: http://www.niccomp.com/; Mounting Technology: Surface Mount; Packaging: Tape and Reel; ComponentLink2URL: https://datasheet.ciiva.com/27056/2008575-27056094.pdf; Min Operating Temperature: -55 degC
R88 = CMP-2002-00609-3: Chip Resistor, 1 MOhm, +/- 1%, 100 mW, -55 to 155 degC, 0402 (1005 Metric), RoHS, Tape and Reel; Manufacturer: Basic Passives; Power Rating: 100 mW; Voltage Rating: 50 V; Case\/Package: 0402; Mount: Surface Mount; PartNumber: ERJ-2RKF1004X; Height: 0.35 mm; PackageDescription: 2-Pin Surface Mount Device, Body 1 x 0.5 mm; Max Operating Temperature: 155 degC; Mounting Technology: Surface Mount; Case Code (Metric): 1005; REACH SVHC: Yes; Length: 1 mm; ComponentLink1URL: http://www.panasonic.com/; Min Operating Temperature: -55 degC; Width: 0.5 mm; Tolerance: 1%; Package Quantity: 10000; ComponentLink1Description: Manufacturer URL; RoHSCompliant: true; Packaging: Tape and Reel; Case Code (Imperial): 0402; Pins: 2; ComponentLink2URL: http://industrial.panasonic.com/cdbs/www-data/pdf/RDA0000/AOA0000C86.pdf; Weight: 2.8E-05oz; Radiation Hardening: No; ComponentLink2Description: Datasheet; DatasheetVersion: 04/2015; PackageReference: 0402
R89 = CMP-2002-00608-3: as R176 on sheet 12V_to_5V; Height: 0.35 mm; ComponentLink1Description: Manufacturer URL; Packaging: Tape and Reel; Min Operating Temperature: -55 degC; RoHSCompliant: true; PackageDescription: 2-Pin Surface Mount Device, Body 1 x 0.5 mm; Mount: Surface Mount; Package Quantity: 10000; Max Operating Temperature: 155 degC; ComponentLink1URL: http://www.panasonic.com/; Tolerance: 1%; Mounting Technology: Surface Mount; PartNumber: ERJ-2RKF1003X; Case Code (Metric): 1005; Case Code (Imperial): 0402; REACH SVHC: Yes; Length: 1 mm; Width: 0.5 mm; DatasheetVersion: 04/2015; Pins: 2; ComponentLink2Description: Datasheet; ComponentLink2URL: http://industrial.panasonic.com/cdbs/www-data/pdf/RDA0000/AOA0000C86.pdf; PackageReference: 0402; Radiation Hardening: No
U6 = CMP-1689-00002-3: PowerSoC Voltage Mode Synchronous PWM Buck with Integrated Inductor, 2.5 to 6.6 V Input, -40 to 85 degC, 38-Pin QFN, RoHS, Tape and Reel; Output Current: 3 A; PackageDescription: 38-Pin Quad Flat No-Leads Package, Body 7 x 4 mm, Pitch 0.5 mm, Thermal Pad 2.6 x 1.94 mm; ComponentLink2Description: Datasheet; PartNumber: EN6337QI; DatasheetVersion: Rev. E; ComponentLink1Description: Manufacturer URL; ComponentLink1URL: https://www.altera.com/; Mounting Technology: Surface Mount; ComponentLink2URL: https://www.altera.com/content/dam/altera-www/global/en_US/pdfs/literature/ds/en6337qi_05800.pdf; Width: 0.16 inch; Pins: 38; Packaging: Tape and Reel; Package Quantity: 500; Mount: Surface Mount; Radiation Hardening: No; RoHSCompliant: True; Max Operating Temperature: 85 degC; Min Operating Temperature: -40 degC; Height: 0.07 inch; Length: 0.28 inch

## Sheet 3V3_to_2V5.SchDoc: 3V3 to 2V5 Converter
size B; DocumentNumber: 46; SheetNumber: 46; SheetTotal: 46
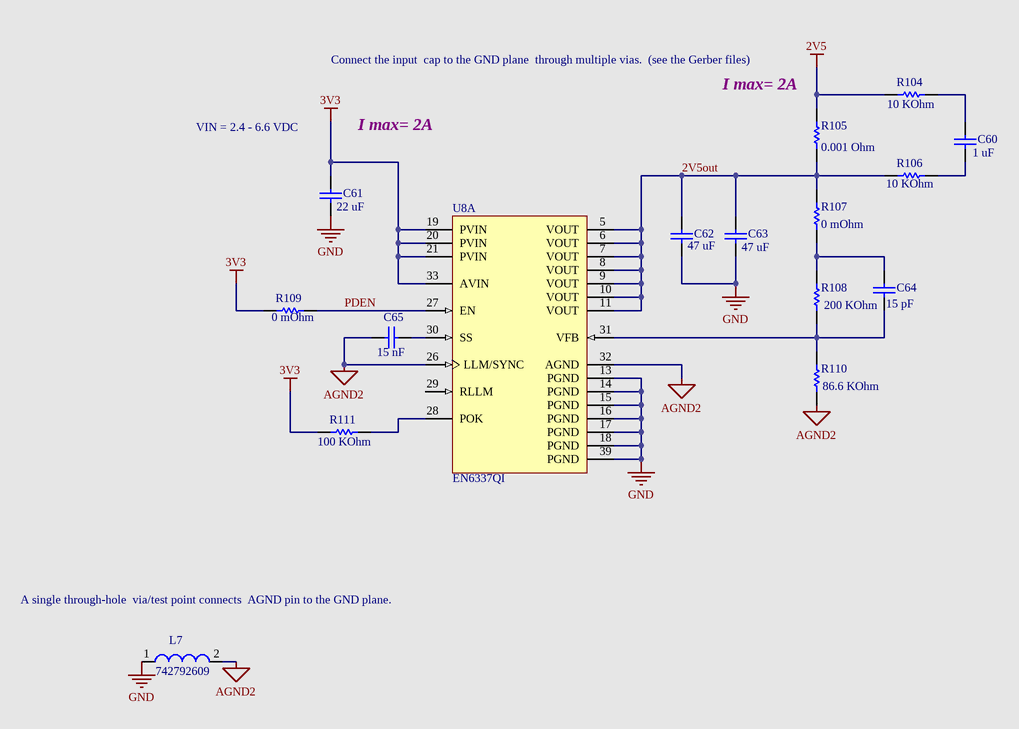
[diagram p47: 3V3_to_2V5.SchDoc]

### Parts
C60  Capacitance: 1 uF  [CAPC1005X33X10LL5]  (hidden comment: CGB2A1X5R1E105K033BC)
C61  Capacitance: 22 uF  [CAPC3216X180X55ML20T25]  (hidden comment: GRM31CR61E226KE15L)
C62  Capacitance: 47 uF  [CAPC3216X180X20ML20]  (hidden comment: C3216X5R1A476M160AB)
C63  Capacitance: 47 uF  [CAPC3216X180X20ML20]  (hidden comment: C3216X5R1A476M160AB)
C64  Capacitance: 15 pF  [CAPC1005X55X20ML5T10]  (hidden comment: ECJ-0EC1H150J)
C65  Capacitance: 15 nF  [CAPC1005X55X23ML05T8]  (hidden comment: VJ0402Y153JXQPW1BC)
L7  742792609  [SMD-0603]
R104  Resistance: 10 KOhm  [RESC1005X40X25NL05T05]  (hidden comment: ERJ-2RKF1002X)
R105  Resistance: 0.001 Ohm  [RESC3216X89X104LL25T25]  (hidden comment: WSLP12061L000FEA)
R106  Resistance: 10 KOhm  [RESC1005X40X25NL05T05]  (hidden comment: ERJ-2RKF1002X)
R107  Resistance: 0 mOhm  [RESC1005X40X25ML05T05]  (hidden comment: ERJ-2GE0R00X)
R108  Resistance: 200 KOhm  [RESC1005X40X25NL05T05]  (hidden comment: ERJ-2RKF2003X)
R109  Resistance: 0 mOhm  [RESC1005X40X25ML05T05]  (hidden comment: ERJ-2GE0R00X)
R110  Resistance: 86.6 KOhm  [RESC1005X40X25ML05T05]  (hidden comment: ERJ-2RKF8662X)
R111  Resistance: 100 KOhm  [RESC1005X40X25LL05T05]  (hidden comment: ERJ-2RKF1003X)
U8  EN6337QI  [ALTR-QFN-38_A-190_D1-193_V]  (part A of 2)

### Nets
2V5: R104.2 R105.2
3V3: C61.2 R109.1 R111.1 U8.19(PVIN) U8.20(PVIN) U8.21(PVIN) U8.33(AVIN)
AGND2: C65.1 L7.2 R110.1 U8.26(LLM/SYNC) U8.32(AGND)
GND: C61.1 C62.1 C63.1 L7.1 U8.13(PGND) U8.14(PGND) U8.15(PGND) U8.16(PGND) U8.17(PGND) U8.18(PGND) U8.39(PGND)
2V5out: C62.2 C63.2 R105.1 R106.2 R107.1 U8.5(VOUT) U8.6(VOUT) U8.7(VOUT) U8.8(VOUT) U8.9(VOUT) U8.10(VOUT) U8.11(VOUT)
PDEN: R109.2 U8.27(EN)
NetC60_1: C60.1 R106.1
NetC60_2: C60.2 R104.1
NetC64_1: C64.1 R108.1 R110.2 U8.31(VFB)
NetC64_2: C64.2 R107.2 R108.2
NetC65_2: C65.2 U8.30(SS)
NetR111_2: R111.2 U8.28(POK)

Not connected (* = marked no-connect by the designer): U8 29(RLLM)

### Notes on the sheet
- Connect the input  cap to the GND plane  through multiple vias.  (see the Gerber files)
- VIN = 2.4 - 6.6 VDC
- I max= 2A
- (near R105) I max= 2A
- A single through-hole  via/test point connects  AGND pin to the GND plane.
- Title
- Size:
- Date:
- B
- Number:
- Time:
- Revision:
- Sheet
- of
- File:

### Library data of the parts
C60 = CMP-1663-00006-2: as C109 on sheet 12V_to_5V; Tolerance: 10%; PackageDescription: 2-Pin Surface Mount Device, Body 1 x 0.5 mm; PartNumber: CGB2A1X5R1E105K033BC; Case Code (Metric): 1005; DatasheetVersion: 04/2015; RoHSCompliant: True; Max Operating Temperature: 85 degC; ComponentLink2URL: https://product.tdk.com/info/en/catalog/datasheets/mlcc_commercial_lowprofile_en.pdf; Package Quantity: 1; Width: 0.02 inch; Case/Package: 0402; Case Code (Imperial): 0402; Packaging: Tape and Reel; Length: 0.039 inch; Min Operating Temperature: -55 degC; Mounting Technology: Surface Mount; ComponentLink2Description: Datasheet; ComponentLink1URL: http://www.tdk.com/; ComponentLink1Description: Manufacturer URL
C61 = CMP-1662-00010-2: as C116 on sheet 12V_to_5V; Tolerance: 10%; Max Operating Temperature: 85 degC; Package Quantity: 2000; Voltage Rating: 25 V; Case Code (Metric): 3216; Length: 3.2 mm; PackageDescription: 2-Pin Surface Mount Device, Body 3.2 x 1.6 mm; ComponentLink1Description: Manufacturer URL; Case Code (Imperial): 1206; ComponentLink1URL: http://www.murata.com/; Radiation Hardening: No; Height: 1.6 mm; Width: 1.6 mm; DatasheetVersion: 03/2016; Min Operating Temperature: -55 degC; Mount: Surface Mount; REACH SVHC: No SVHC; PackageReference: 1206; ComponentLink2URL: http://search.murata.co.jp/Ceramy/image/img/A01X/G101/ENG/GRM31CR61E226KE15-01.pdf; Packaging: Tape and Reel; RoHSCompliant: true; ComponentLink2Description: Datasheet; Mounting Technology: Surface Mount; PartNumber: GRM31CR61E226KE15L; Pins: 2
C62 C63 = CMP-1663-00005-1: as C112 on sheet 12V_to_5V; Tolerance: 20%; Voltage Rating: 10 V; Packaging: Tape and Reel; ComponentLink2URL: https://product.tdk.com/info/en/catalog/datasheets/mlcc_commercial_general_en.pdf; Min Operating Temperature: -55 degC; Length: 3.2 mm; Radiation Hardening: No; Mounting Technology: Surface Mount; PackageDescription: 2-Pin Surface Mount Device, Body 3.2 x 1.6 mm; Max Operating Temperature: 85 degC; Case Code (Metric): 3216; ComponentLink1URL: http://www.tdk.com/; DatasheetVersion: 03/2015; Mount: Surface Mount; Case Code (Imperial): 1206; Package Quantity: 2000; ComponentLink2Description: Datasheet; PackageReference: 3216; Height: 1.6 mm; RoHSCompliant: true; Width: 1.6 mm; ComponentLink1Description: Manufacturer URL
C64 = CMP-1665-00025-1: as C48 on sheet 3V3_to_0V9; Tolerance: 5%; Mount: Surface Mount; Length: 0.039 inch; ComponentLink1Description: Manufacturer URL; Height: 0.5 mm; PackageReference: 0402; DatasheetVersion: 09/2008; Case Code (Metric): 1005; ComponentLink2URL: http://www.mouser.com/ds/2/315/panasonic_abj0000ce4-327307.pdf; Width: 0.02 inch; Mounting Technology: Surface Mount; Case Code (Imperial): 0402; PackageDescription: 2-Pin Surface Mount Device, Body 1 x 0.5 mm; Packaging: Tape and Reel; ComponentLink1URL: http://www.panasonic.com/; RoHSCompliant: true; Max Operating Temperature: 125 degC; Package Quantity: 10000; Min Operating Temperature: -55 degC; ComponentLink2Description: Datasheet
C65 = CMP-1666-00015-3: as C14 on sheet 3.3V_to_0.9V; DatasheetVersion: 07/2016; ComponentLink1Description: Manufacturer URL; ComponentLink1URL: http://www.vishay.com/; PackageDescription: 2-Pin Surface Mount Device, Body 1 x 0.5 mm; ComponentLink2URL: http://www.vishay.com/docs/28548/vjw1bcbascomseries.pdf; ComponentLink2Description: Datasheet; Mounting Technology: Surface Mount; Length: 1 mm; PartNumber: VJ0402Y153JXQPW1BC; RoHSCompliant: true; Package Quantity: 50000; Min Operating Temperature: -55 degC; Case Code (Metric): 1005; Max Operating Temperature: 125 degC; Width: 0.5 mm; Tolerance: 5%; Packaging: Tape and Reel; Case Code (Imperial): 0402; Height: 0.5 mm; PackageReference: 0402; Mount: Surface Mount; Pins: 2; Voltage Rating: 10 V
L7 = CMP-0220-00193-1: as L10 on sheet 12V_to_5V; ComponentLink2URL: http://www.we-online.de/katalog/media/pdf/742792609.pdf; ComponentLink1URL: http://www.we-online.com; ComponentLink2Description: Datasheet; PackageDescription: Chip Inductor, 2-Leads, Body 1.6 x 0.8 mm; ComponentLink1Description: Manufacturer Link; PackageReference: SMD-0603; DatasheetVersion: Dec-2005; PackageVersion: 2009
R104 R106 = CMP-2002-00607-3: as R175 on sheet 12V_to_5V; Case Code (Imperial): 0402; Min Operating Temperature: -55 degC; PartNumber: ERJ-2RKF1002X; Mounting Technology: Surface Mount; Length: 1 mm; Packaging: Tape and Reel; ComponentLink1Description: Manufacturer URL; Mount: Surface Mount; Package Quantity: 10000; Max Operating Temperature: 155 degC; Case Code (Metric): 1005; Height: 0.35 mm; ComponentLink1URL: http://www.panasonic.com/; Tolerance: 1%; REACH SVHC: Yes; RoHSCompliant: true; Width: 0.5 mm; PackageDescription: 2-Pin Surface Mount Device, Body 1 x 0.5 mm; Radiation Hardening: No; PackageReference: 0402; ComponentLink2Description: Datasheet; DatasheetVersion: 04/2015; ComponentLink2URL: http://industrial.panasonic.com/cdbs/www-data/pdf/RDA0000/AOA0000C86.pdf; Pins: 2
R105 = CMP-1666-00018-2: as R27 on sheet 3.3V_to_0.9V; Tolerance: 1%; RoHSCompliant: True; Mounting Technology: Surface Mount; ComponentLink1URL: http://www.vishay.com/; Min Operating Temperature: -65 degC; Height: 0.635 mm; ComponentLink2URL: http://www.farnell.com/datasheets/2049155.pdf; Length: 3.2 mm; ComponentLink2Description: Datasheet; ComponentLink1Description: Manufacturer URL; DatasheetVersion: 04/2015; Case Code (Imperial): 1206; Max Operating Temperature: 170 degC; Packaging: Tape and Reel; Case/Package: 1206; Width: 1.6 mm; PartNumber: WSLP12061L000FEA; REACH SVHC: Unknown; PackageDescription: 2-Pin Surface Mount Device, Body 3.2 x 1.6 mm; Case Code (Metric): 3216
R107 R109 = CMP-2002-00429-3: as R173 on sheet 12V_to_5V; Max Operating Temperature: 155 degC; Tolerance: 5%; PartNumber: ERJ-2GE0R00X; Case Code (Imperial): 0402; Package Quantity: 10000; Length: 1 mm; Mounting Technology: Surface Mount; ComponentLink1URL: http://www.panasonic.com/; Height: 0.35 mm; Width: 0.5 mm; Min Operating Temperature: -55 degC; Case Code (Metric): 1005; RoHSCompliant: true; REACH SVHC: Unknown; ComponentLink1Description: Manufacturer URL; Packaging: Tape and Reel; Mount: Surface Mount; PackageDescription: 2-Pin Surface Mount Device, Body 1 x 0.5 mm; PackageReference: 0402; ComponentLink2URL: http://industrial.panasonic.com/cdbs/www-data/pdf/RDA0000/AOA0000C84.pdf; DatasheetVersion: 03/2015; Radiation Hardening: No; Pins: 2; ComponentLink2Description: Datasheet
R108 = CMP-2002-00760-3: as R86 on sheet 3V3_to_0V9; ComponentLink1Description: Manufacturer URL; PackageDescription: 2-Pin Surface Mount Device, Body 1 x 0.5 mm; RoHSCompliant: true; PartNumber: ERJ-2RKF2003X; Max Operating Temperature: 155 degC; Width: 0.5 mm; Mounting Technology: Surface Mount; Package Quantity: 10000; REACH SVHC: No SVHC; Packaging: Tape and Reel; Length: 1 mm; Mount: Surface Mount; ComponentLink1URL: http://www.panasonic.com/; Case Code (Imperial): 0402; Min Operating Temperature: -55 degC; Height: 0.35 mm; Tolerance: 1%; Case Code (Metric): 1005; DatasheetVersion: 04/2015; ComponentLink2URL: http://industrial.panasonic.com/cdbs/www-data/pdf/RDA0000/AOA0000C86.pdf; ComponentLink2Description: Datasheet; PackageReference: 0402; Radiation Hardening: No; Pins: 2
R110 = CMP-2002-01090-3: Chip Resistor, 86.6 KOhm, +/- 1%, 100 mW, -55 to 155 degC, 0402 (1005 Metric), RoHS, Tape and Reel; Manufacturer: Basic Passives; Voltage Rating: 50 V; Power Rating: 100 mW; Case\/Package: 0402; Min Operating Temperature: -55 degC; REACH SVHC: Yes; PartNumber: ERJ-2RKF8662X; Width: 0.5 mm; ComponentLink1URL: http://www.panasonic.com/; Case Code (Imperial): 0402; Packaging: Tape and Reel; Mounting Technology: Surface Mount; RoHSCompliant: true; Max Operating Temperature: 155 degC; Length: 1 mm; Case Code (Metric): 1005; PackageDescription: 2-Pin Surface Mount Device, Body 1 x 0.5 mm; ComponentLink1Description: Manufacturer URL; Tolerance: 1%; Package Quantity: 10000; Mount: Surface Mount; Height: 0.35 mm; ComponentLink2Description: Datasheet; ComponentLink2URL: http://industrial.panasonic.com/cdbs/www-data/pdf/RDA0000/AOA0000C86.pdf; DatasheetVersion: 04/2015; Pins: 2; PackageReference: 0402
R111 = CMP-2002-00608-3: as R176 on sheet 12V_to_5V; Height: 0.35 mm; ComponentLink1Description: Manufacturer URL; Packaging: Tape and Reel; Min Operating Temperature: -55 degC; RoHSCompliant: true; PackageDescription: 2-Pin Surface Mount Device, Body 1 x 0.5 mm; Mount: Surface Mount; Package Quantity: 10000; Max Operating Temperature: 155 degC; ComponentLink1URL: http://www.panasonic.com/; Tolerance: 1%; Mounting Technology: Surface Mount; PartNumber: ERJ-2RKF1003X; Case Code (Metric): 1005; Case Code (Imperial): 0402; REACH SVHC: Yes; Length: 1 mm; Width: 0.5 mm; DatasheetVersion: 04/2015; Pins: 2; ComponentLink2Description: Datasheet; ComponentLink2URL: http://industrial.panasonic.com/cdbs/www-data/pdf/RDA0000/AOA0000C86.pdf; PackageReference: 0402; Radiation Hardening: No
U8 = CMP-1689-00002-3: as U6 on sheet 3V3_to_0V9; PackageDescription: 38-Pin Quad Flat No-Leads Package, Body 7 x 4 mm, Pitch 0.5 mm, Thermal Pad 2.6 x 1.94 mm; ComponentLink2Description: Datasheet; PartNumber: EN6337QI; DatasheetVersion: Rev. E; ComponentLink1Description: Manufacturer URL; ComponentLink1URL: https://www.altera.com/; Mounting Technology: Surface Mount; ComponentLink2URL: https://www.altera.com/content/dam/altera-www/global/en_US/pdfs/literature/ds/en6337qi_05800.pdf; Width: 0.16 inch; Pins: 38; Packaging: Tape and Reel; Package Quantity: 500; Mount: Surface Mount; Radiation Hardening: No; RoHSCompliant: True; Max Operating Temperature: 85 degC; Min Operating Temperature: -40 degC; Height: 0.07 inch; Length: 0.28 inch